# EAGLE design HAP-ControlUnit-DIL-3.0 (EAGLE 5.04)
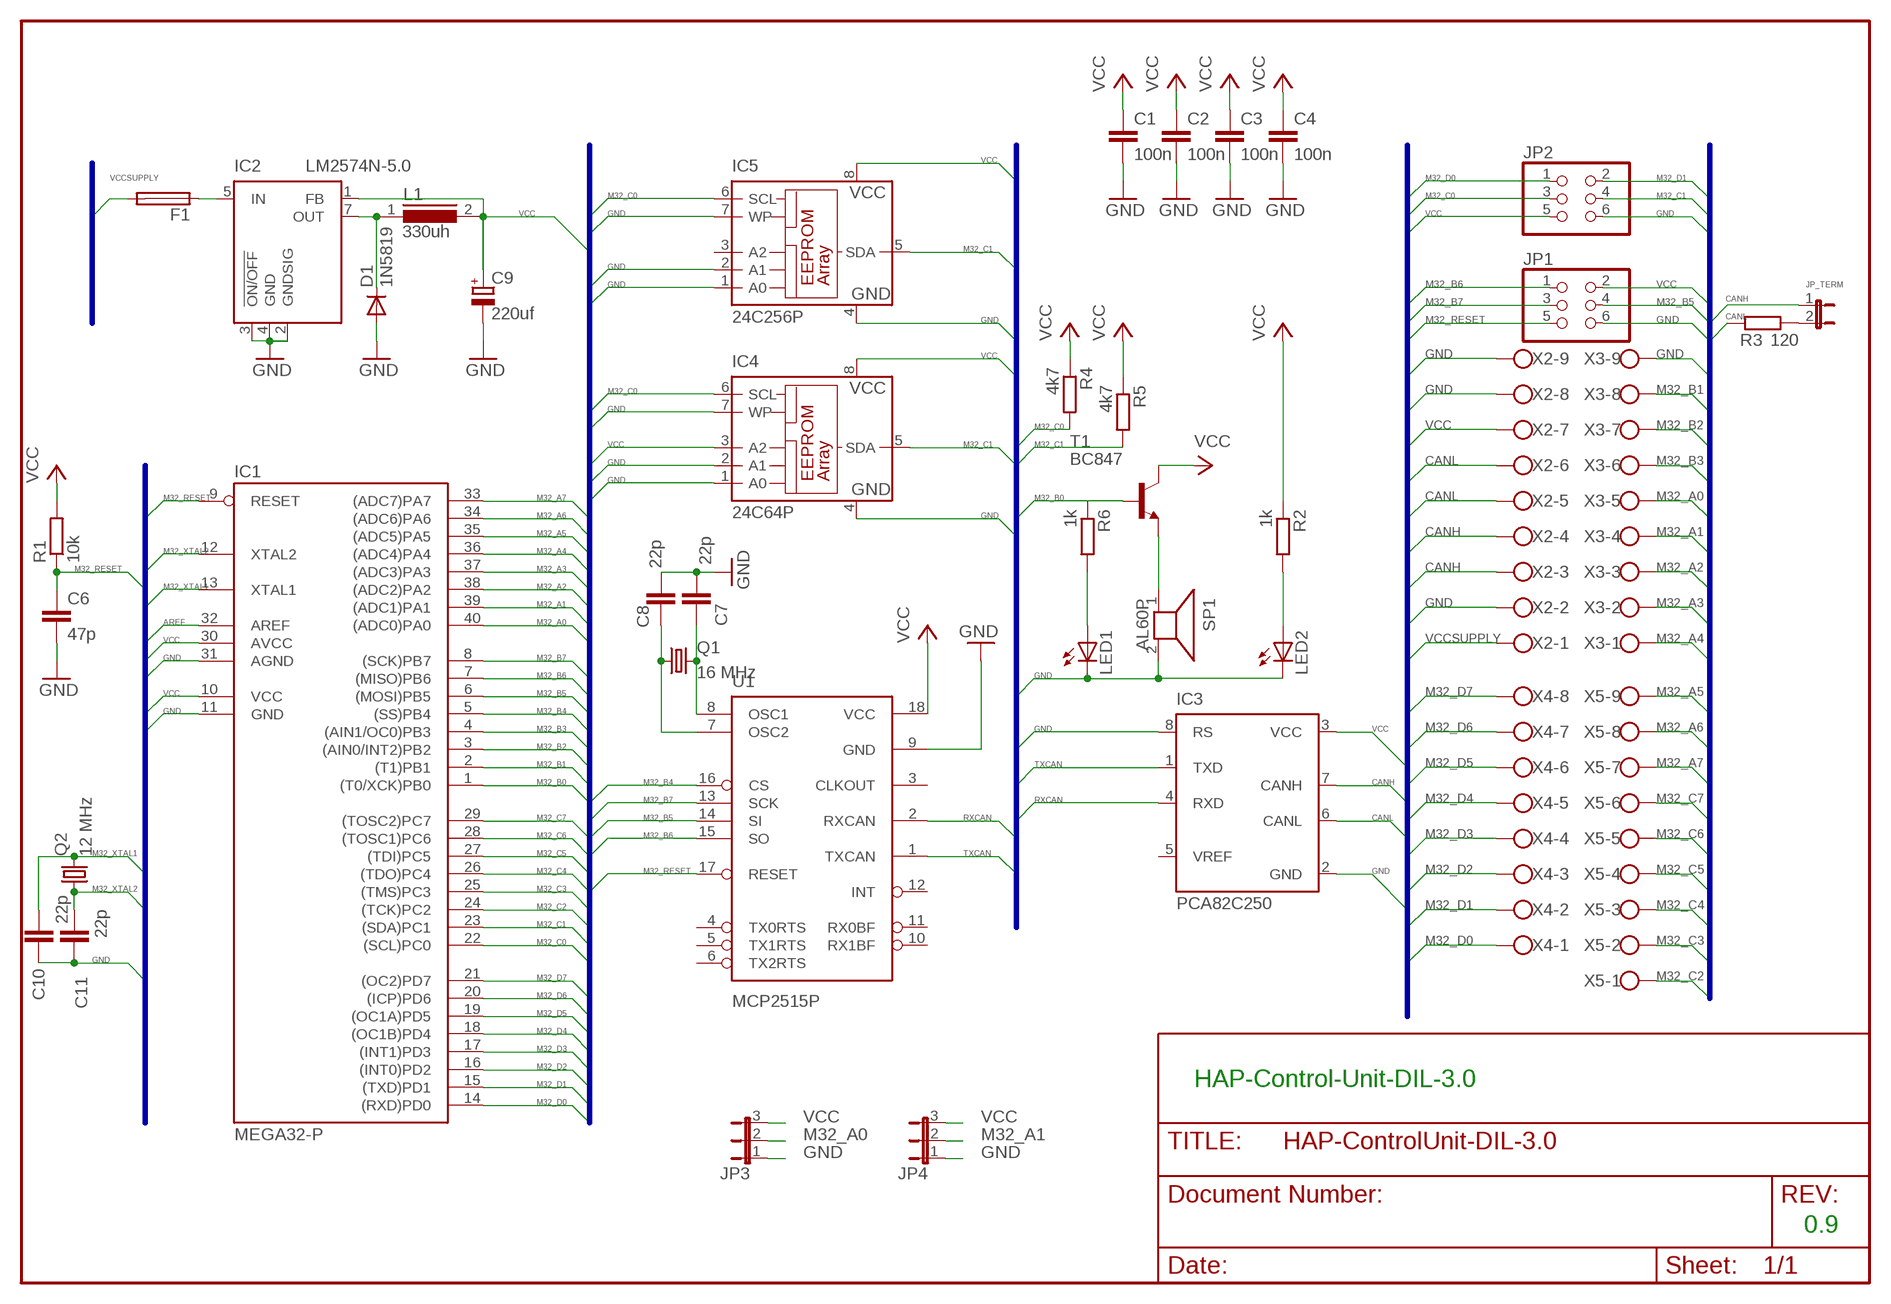
[diagram p0: schematic, sheet 1]

## Parts
C1  100n  C-EUC0805  [C0805]
C2  100n  C-EUC0805  [C0805]
C3  100n  C-EUC0805  [C0805]
C4  100n  C-EUC0805  [C0805]
C6  47p  C-EUC0805  [C0805]
C7  22p  C-EUC0805  [C0805]
C8  22p  C-EUC0805  [C0805]
C9  220uf  CPOL-EUE3.5-8  [E3,5-8]
C10  22p  C-EUC0805  [C0805]
C11  22p  C-EUC0805  [C0805]
D1  1N5819  1N4446  [DO35-10]
F1  TR5  [TR5]
IC1  MEGA32-P  [DIL40]
IC2  LM2574N-5.0  [DIL08]
IC3  PCA82C250  [DIL08]
IC4  24C64P  [DIL8]
IC5  24C256P  24C64P  [DIL8]
JP1  PINHD-2X3  [2X03]
JP2  PINHD-2X3  [2X03]
JP3  JP2E  [JP2]
JP4  JP2E  [JP2]
JP_TERM  JP1E  [JP1]
L1  330uh  82114R  [82114R]
LED1  LED3MM  [LED3MM]
LED2  LED3MM  [LED3MM]
Q1  16 MHz  CRYSTALHC49U70  [HC49U70]
Q2  12 MHz  CRYSTALHC49U70  [HC49U70]
R1  10k  R-EU_R0805  [R0805]
R2  1k  R-EU_R0805  [R0805]
R3  120  R-EU_R0805  [R0805]
R4  4k7  R-EU_R0805  [R0805]
R5  4k7  R-EU_R0805  [R0805]
R6  1k  R-EU_R0805  [R0805]
SP1  AL60P  [AL60P]
T1  BC847  [SOT23]
U1  MCP2515P  MCP2510P  [DIL18]
X2  W237-09P  [W237-9P]
X3  W237-09P  [W237-9P]
X4  W237-08P  [W237-8P]
X5  W237-09P  [W237-9P]

## Nets
AREF: IC1.32(AREF)
CANH: IC3.7(CANH) JP_TERM.1 X2.3 X2.4
CANL: IC3.6(CANL) R3.1 X2.5 X2.6
GND [VCC_GND]: C1.2 C2.2 C3.2 C4.2 C6.2 C7.2 C8.2 C9.- C10.2 C11.1 D1.A IC1.11(GND) IC1.31(AGND) IC2.2(GNDSIG) IC2.3(!ON/OFF) IC2.4(GND) IC3.2(GND) IC3.8(RS) IC4.1(A0) IC4.2(A1) IC4.4(GND) IC4.7(WP) IC5.1(A0) IC5.2(A1) IC5.4(GND) IC5.7(WP) JP1.6 JP2.6 JP3.1 JP4.1 LED1.K(C) LED2.K(C) SP1.2 U1.9(GND) X2.2 X2.8 X2.9 X3.9
M32_A0: IC1.40((ADC0)PA0) JP3.2 X3.5
M32_A1: IC1.39((ADC1)PA1) JP4.2 X3.4
M32_A2: IC1.38((ADC2)PA2) X3.3
M32_A3: IC1.37((ADC3)PA3) X3.2
M32_A4: IC1.36((ADC4)PA4) X3.1
M32_A5: IC1.35((ADC5)PA5) X5.9
M32_A6: IC1.34((ADC6)PA6) X5.8
M32_A7: IC1.33((ADC7)PA7) X5.7
M32_B0: IC1.1((T0/XCK)PB0) R6.1 T1.1(B)
M32_B1: IC1.2((T1)PB1) X3.8
M32_B2: IC1.3((AIN0/INT2)PB2) X3.7
M32_B3: IC1.4((AIN1/OC0)PB3) X3.6
M32_B4: IC1.5((SS)PB4) U1.16(CS)
M32_B5: IC1.6((MOSI)PB5) JP1.4 U1.14(SI)
M32_B6: IC1.7((MISO)PB6) JP1.1 U1.15(SO)
M32_B7: IC1.8((SCK)PB7) JP1.3 U1.13(SCK)
M32_C0: IC1.22((SCL)PC0) IC4.6(SCL) IC5.6(SCL) JP2.3 R4.2
M32_C1: IC1.23((SDA)PC1) IC4.5(SDA) IC5.5(SDA) JP2.4 R5.2
M32_C2: IC1.24((TCK)PC2) X5.1
M32_C3: IC1.25((TMS)PC3) X5.2
M32_C4: IC1.26((TDO)PC4) X5.3
M32_C5: IC1.27((TDI)PC5) X5.4
M32_C6: IC1.28((TOSC1)PC6) X5.5
M32_C7: IC1.29((TOSC2)PC7) X5.6
M32_D0: IC1.14((RXD)PD0) JP2.1 X4.1
M32_D1: IC1.15((TXD)PD1) JP2.2 X4.2
M32_D2: IC1.16((INT0)PD2) X4.3
M32_D3: IC1.17((INT1)PD3) X4.4
M32_D4: IC1.18((OC1B)PD4) X4.5
M32_D5: IC1.19((OC1A)PD5) X4.6
M32_D6: IC1.20((ICP)PD6) X4.7
M32_D7: IC1.21((OC2)PD7) X4.8
M32_RESET: C6.1 IC1.9(RESET) JP1.5 R1.1 U1.17(RESET)
M32_XTAL1: C10.1 IC1.13(XTAL1) Q2.2
M32_XTAL2: C11.2 IC1.12(XTAL2) Q2.1
N$1: LED1.A R6.2
N$2: D1.C IC2.7(OUT) L1.1
N$3: SP1.1 T1.2(E)
N$4: F1.1 IC2.5(IN)
N$5: C7.1 Q1.2 U1.8(OSC1)
N$6: JP_TERM.2 R3.2
N$7: C8.1 Q1.1 U1.7(OSC2)
N$16: LED2.A R2.2
RXCAN: IC3.4(RXD) U1.2(RXCAN)
TXCAN: IC3.1(TXD) U1.1(TXCAN)
VCC [VCC_GND]: C1.1 C2.1 C3.1 C4.1 C9.+ IC1.10(VCC) IC1.30(AVCC) IC2.1(FB) IC3.3(VCC) IC4.3(A2) IC4.8(VCC) IC5.8(VCC) JP1.2 JP2.5 JP3.3 JP4.3 L1.2 R1.2 R2.1 R4.1 R5.1 T1.3(C) U1.18(VCC) X2.7
VCCSUPPLY [VCC_GND]: F1.2 X2.1
Unconnected: IC3.5(VREF) IC5.3(A2) U1.3(CLKOUT) U1.4(TX0RTS) U1.5(TX1RTS) U1.6(TX2RTS) U1.10(RX1BF) U1.11(RX0BF) U1.12(INT)

## Buses
M32_RESET,M32_XTAL2,M32_XTAL1,M32_AREF,M32_AVCC,M32_AGND,M32_A[0..7],M32_B[0..7],M32_C[0..7],M32_D[0..7],VCC,GND,TXCAN,RXCAN,CANH,CANHB,CANL,CANLB,VCCSUPPLY,M32_XTAL1,M32_XTAL2,MCP_OSC1,MCP_OSC2,AREF

## Notes on the sheet
- HAP-Control-Unit-DIL-3.0
- 0.9

## Library data of the parts
C1-C4 C6-C8 C10 C11 = rcl:C-EU: CAPACITOR, European symbol
C9 = rcl:CPOL-EU: POLARIZED CAPACITOR, European symbol
D1 = diode:1N4446: DIODE high speed (Philips)
F1 = fuse:TR5: FUSE Wickmann
IC1 = atmel:MEGA32-P: MICROCONTROLLER 32 Kbytes FLASH 2 Kbytes SRAM 1 Kbytes EEPROM USART 8-channel 10 bit ADC Source: www.atmel.com .. doc2503.pdf
IC2 = linear:LM2574?-*: SIMPLE SWITCHER 0.5A Step-Down Voltage Regulator Source: http://cache.national.com/ds/LM/LM2574.pdf
IC3 = micro-philips:PCA82C250: CAN CONTROLLER INTERFACE
IC4 IC5 = microchip:24*: Serial EEPROM I2C
JP1 JP2 = pinhead:PINHD-2X3: PIN HEADER
JP3 JP4 = jumper:JP2E: JUMPER
JP_TERM = jumper:JP1E: JUMPER
L1 = inductors:82114R: INDUCTOR
LED1 LED2 = led:LED: LED OSRAM: - CHIPLED LG R971, LG N971, LY N971, LG Q971, LY Q971, LO R971, LY R971 LH N974, LH R974 LS Q976, LO Q976, LY Q976 LO Q996 - Hyper CHIPLED LW Q18S LB Q993, LB Q99A, LB R99A - SideLED LS A670, LO A670, LY A670, LG A670, LP A670 LB A673, LV A673, LT A673, LW A673 LH A674 LY A675 LS A676, LA A676, LO A676, LY A676, LW A676 LS A679, LY A679, LG A679 - Hyper Micro SIDELED® LS Y876, LA Y876, LO Y876, LY Y876 LT Y87S - SmartLED LW L88C, LW L88S LB L89C, LB L89S, LG L890 LS L89K, LO L89K, LY L89K LS L896, LA L896, LO L896, LY L896 - TOPLED LS T670, LO T670, LY T670, LG T670, LP T670 LSG T670, LSP T670, LSY T670, LOP T670, LYG T670 LG T671, LOG T671, LSG T671 LB T673, LV T673, LT T673, LW T673 LH T674 LS T676, LA T676, LO T676, LY T676, LB T676, LH T676, LSB T676, LW T676 LB T67C, LV T67C, LT T67C, LS T67K, LO T67K, LY T67K, LW E67C LS E67B, LA E67B, LO E67B, LY E67B, LB E67C, LV E67C, LT E67C LW T67C LS T679, LY T679, LG T679 LS T770, LO T770, LY T770, LG T770, LP T770 LB T773, LV T773, LT T773, LW T773 LH T774 LS E675, LA E675, LY E675, LS T675 LS T776, LA T776, LO T776, LY T776, LB T776 LHGB T686 LT T68C, LB T68C - Hyper Mini TOPLED® LB M676 - Mini TOPLED Santana® LG M470 LS M47K, LO M47K, LY M47K Source: http://www.osram.convergy.de - LUMILED® LXK2-PW12-R00, LXK2-PW12-S00, LXK2-PW14-U00, LXK2-PW14-V00 LXK2-PM12-R00, LXK2-PM12-S00, LXK2-PM14-U00 LXK2-PE12-Q00, LXK2-PE12-R00, LXK2-PE12-S00, LXK2-PE14-T00, LXK2-PE14-U00 LXK2-PB12-K00, LXK2-PB12-L00, LXK2-PB12-M00, LXK2-PB14-N00, LXK2-PB14-P00, LXK2-PB14-Q00 LXK2-PR12-L00, LXK2-PR12-M00, LXK2-PR14-Q00, LXK2-PR14-R00 LXK2-PD12-Q00, LXK2-PD12-R00, LXK2-PD12-S00 LXK2-PH12-R00, LXK2-PH12-S00 LXK2-PL12-P00, LXK2-PL12-Q00, LXK2-PL12-R00 Source: www.luxeon.com
Q1 Q2 = crystal:CRYSTAL: CRYSTAL
R1-R6 = rcl:R-EU_: RESISTOR, European symbol
SP1 = buzzer:AL60P: SPEAKER Source: Buerklin
T1 = transistor:BC847: NPN TRANSISTOR
U1 = microchip_can:MCP2510
X2 X3 X5 = con-wago-508:W237-09P: WAGO SREW CLAMP
X4 = con-wago-508:W237-08P: WAGO SREW CLAMP

## Net classes
1 VCC_GND: width 0.305 mm, clearance 0.203 mm

## Board
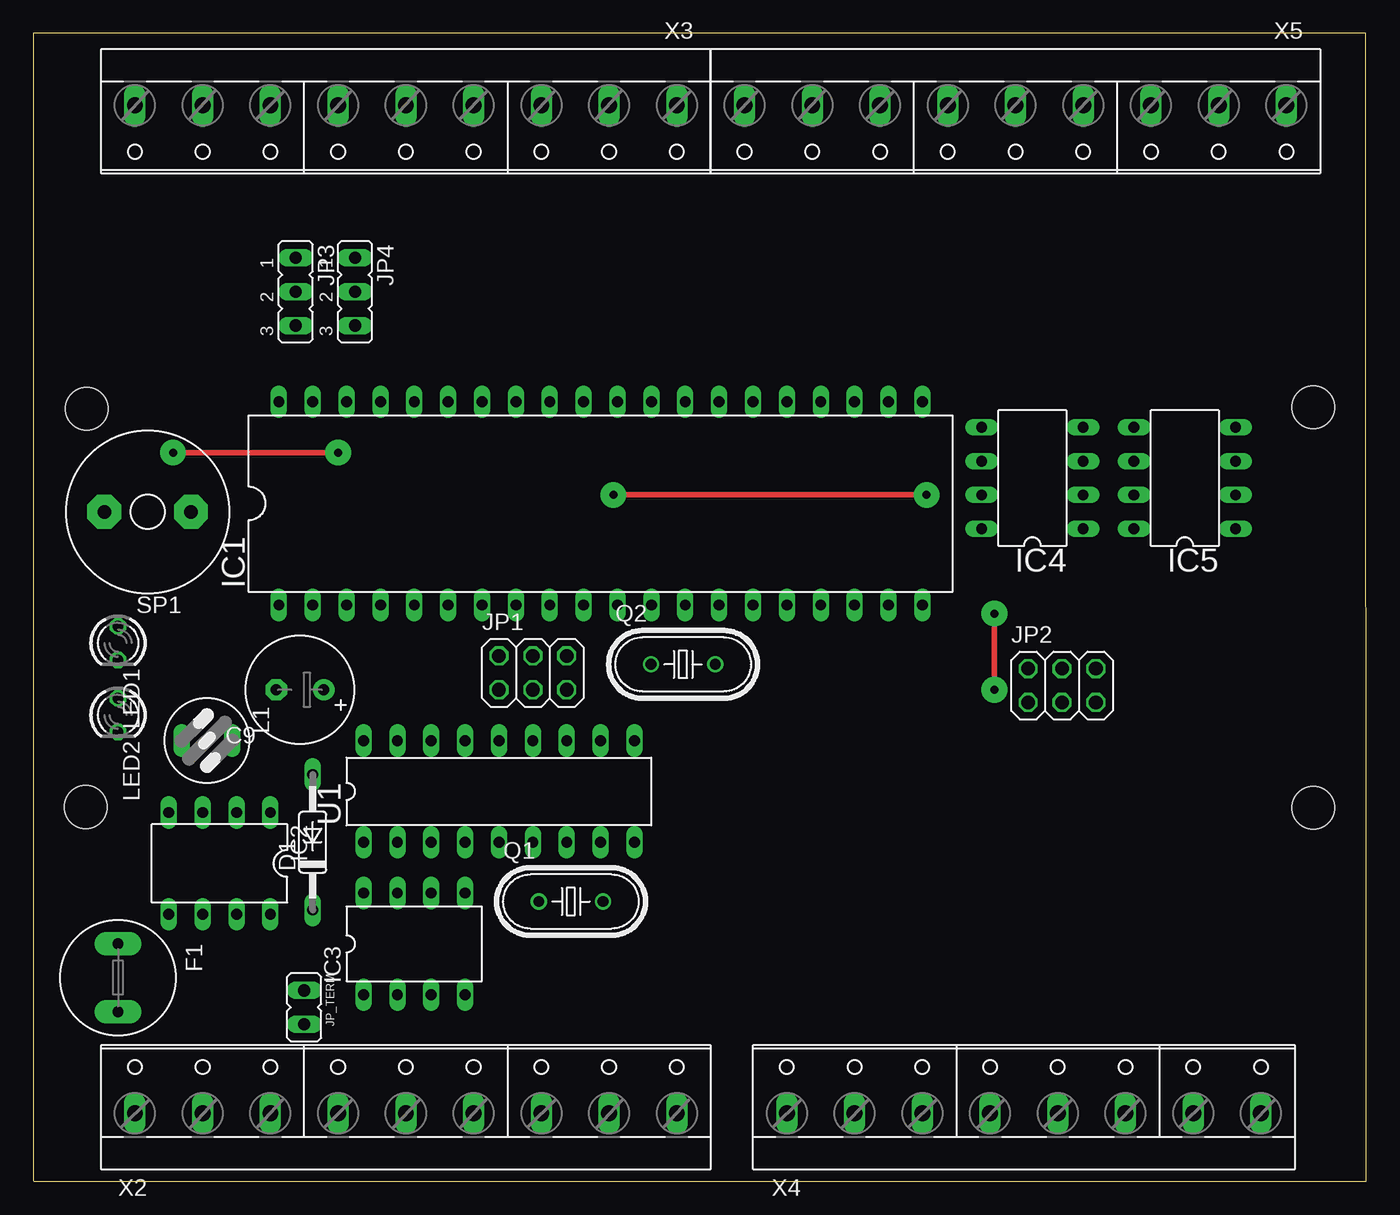
[diagram p1: board, top side]
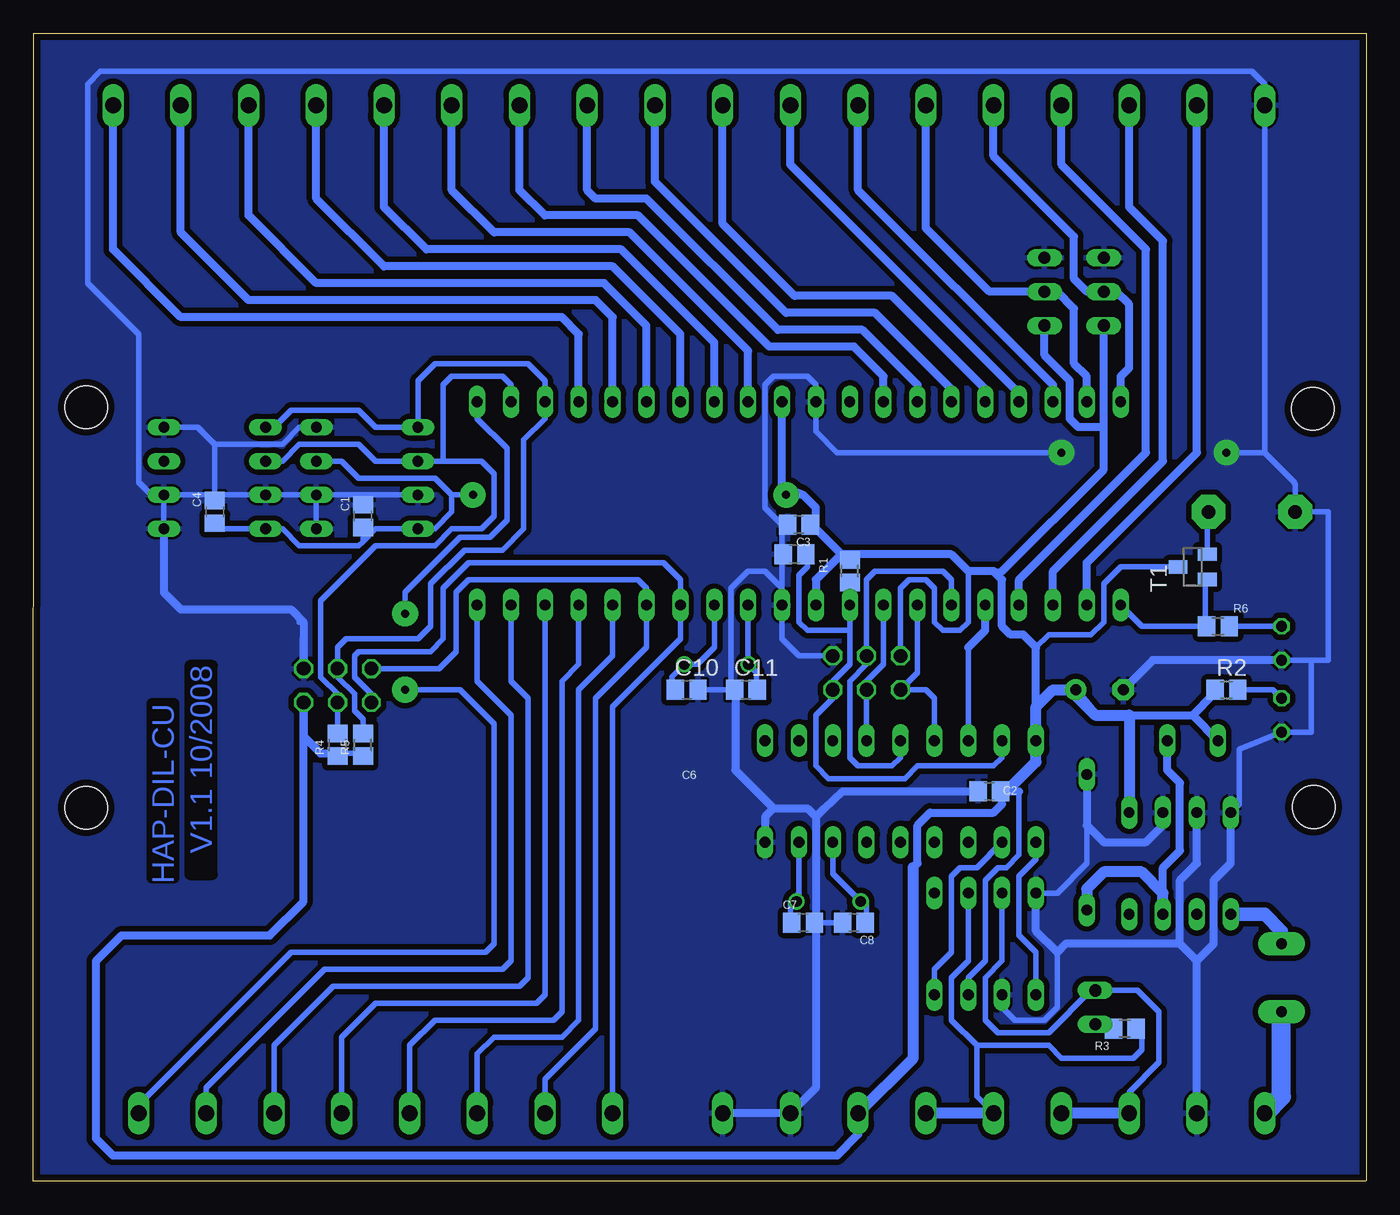
[diagram p2: board, bottom side, seen from below]

Size 99.97 x 86.08 mm. Coordinates in mm from the lower left corner, seen from the top.
Outline: 0.04,0 99.97,0 99.94,86.08 0,86.08 0,0.04
Copper layers (1*16): Top 0.035mm / dielectric 1.5mm / Bottom 0.035mm
Design rules "leiton *": minimum track width 6mil, minimum drill 12mil, track to track 16mil, track to pad 16mil, pad to pad 16mil, via to via 16mil, smd to smd 16mil, copper to edge 20mil, drill to drill 8mil, minimum pad ring 8mil, minimum via ring 6mil, stop-mask expansion 3mil, vias tented up to drill 0mil, thermal gap 8mil
Holes 3.2 mm at 4.01,57.94 96,28.01 3.94,28.07 96,58.04

### Footprints (pad centres in the part's own frame; a part is rotated, then mirrored left to right if it is on the bottom)
C0805 = smd 1.3 x 1.5: 1 -0.85,0; 2 0.85,0
E3,5-8 = drill 0.813 pad 1.6 round: + -1.778,0 | drill 0.813 pad 1.6 octagon: - 1.778,0
DO35-10 = drill 0.813 long: A 5.08,0; C -5.08,0
TR5 = drill 0.813 pad 1.778 long: 1 -2.54,0; 2 2.54,0
DIL40 = drill 0.813 long: 1 -24.13,-7.62; 2 -21.59,-7.62; 3 -19.05,-7.62; 4 -16.51,-7.62; 5 -13.97,-7.62; 6 -11.43,-7.62; 7 -8.89,-7.62; 8 -6.35,-7.62; 9 -3.81,-7.62; 10 -1.27,-7.62; 11 1.27,-7.62; 12 3.81,-7.62; 13 6.35,-7.62; 14 8.89,-7.62; 15 11.43,-7.62; 16 13.97,-7.62; 17 16.51,-7.62; 18 19.05,-7.62; 19 21.59,-7.62; 20 24.13,-7.62; 21 24.13,7.62; 22 21.59,7.62; 23 19.05,7.62; 24 16.51,7.62; 25 13.97,7.62; 26 11.43,7.62; 27 8.89,7.62; 28 6.35,7.62; 29 3.81,7.62; 30 1.27,7.62; 31 -1.27,7.62; 32 -3.81,7.62; 33 -6.35,7.62; 34 -8.89,7.62; 35 -11.43,7.62; 36 -13.97,7.62; 37 -16.51,7.62; 38 -19.05,7.62; 39 -21.59,7.62; 40 -24.13,7.62
DIL08 = drill 0.813 long: 1 -3.81,-3.81; 2 -1.27,-3.81; 3 1.27,-3.81; 4 3.81,-3.81; 5 3.81,3.81; 6 1.27,3.81; 7 -1.27,3.81; 8 -3.81,3.81
DIL8 = drill 0.813 long: 1 -3.81,-3.81; 2 -1.27,-3.81; 3 1.27,-3.81; 4 3.81,-3.81; 5 3.81,3.81; 6 1.27,3.81; 7 -1.27,3.81; 8 -3.81,3.81
2X03 = drill 1.016 octagon: 1 -2.54,-1.27; 2 -2.54,1.27; 3 0,-1.27; 4 0,1.27; 5 2.54,-1.27; 6 2.54,1.27
JP2 = drill 0.914 long: 1 -2.54,0; 2 0,0; 3 2.54,0
JP1 = drill 0.914 long: 1 0,-1.27; 2 0,1.27
82114R = drill 0.813 long: 1 0,1.905; 2 0,-1.905
LED3MM = drill 0.813 octagon: A -1.27,0; K 1.27,0
HC49U70 = drill 0.813 round: 1 -2.413,0; 2 2.413,0
R0805 = smd 1.3 x 1.5: 1 -0.85,0; 2 0.85,0
AL60P = drill 1.016 pad 2.54 octagon: 1 -3.251,0; 2 3.251,0
SOT23 = smd 1 x 1.4: 1 -0.95,-1.1; 2 0.95,-1.1; 3 0,1.1
DIL18 = drill 0.813 long: 1 -10.16,-3.81; 2 -7.62,-3.81; 3 -5.08,-3.81; 4 -2.54,-3.81; 5 0,-3.81; 6 2.54,-3.81; 7 5.08,-3.81; 8 7.62,-3.81; 9 10.16,-3.81; 10 10.16,3.81; 11 7.62,3.81; 12 5.08,3.81; 13 2.54,3.81; 14 0,3.81; 15 -2.54,3.81; 16 -5.08,3.81; 17 -7.62,3.81; 18 -10.16,3.81
W237-9P = drill 1.194 long: 1 -20.32,-0.635; 2 -15.24,-0.635; 3 -10.16,-0.635; 4 -5.08,-0.635; 5 0,-0.635; 6 5.08,-0.635; 7 10.16,-0.635; 8 15.24,-0.635; 9 20.32,-0.635
W237-8P = drill 1.194 long: 1 -17.78,-0.635; 2 -12.7,-0.635; 3 -7.62,-0.635; 4 -2.54,-0.635; 5 2.54,-0.635; 6 7.62,-0.635; 7 12.7,-0.635; 8 17.78,-0.635

### Placement (x,y rotation side)
C1  75.25,49.88 90 bottom
C2  28.26,29.25 180 bottom
C3  42.55,49.25 180 bottom
C4  86.36,50.2 90 bottom
C6  42.86,47.02 180 bottom
C7  42.23,19.4 0 bottom
C8  38.42,19.4 180 bottom
C9  20,36.86 180 top
C10  50.96,36.86 0 bottom
C11  46.51,36.86 0 bottom
D1  20.95,25.43 90 top
F1  6.35,15.28 270 top
IC1  42.55,50.83 0 top
IC2  13.97,23.85 180 top
IC3  28.57,17.82 0 top
IC4  74.93,52.74 90 top
IC5  86.36,52.74 90 top
JP1  37.47,38.13 0 top
JP2  77.15,37.18 0 top
JP3  19.68,66.71 270 top
JP4  24.13,66.71 270 top
JP_TERM  20.32,13.05 180 top
L1  13.02,33.05 270 top
LED1  6.35,40.36 270 top
LED2  6.35,34.96 270 top
Q1  40.32,20.99 0 top
Q2  48.74,38.77 0 top
R1  38.73,45.75 90 bottom
R2  10.48,36.86 0 bottom
R3  18.1,11.46 180 bottom
R4  77.15,32.74 90 bottom
R5  75.25,32.74 90 bottom
R6  11.11,41.63 0 bottom
SP1  8.57,50.2 180 top
T1  13.02,46.07 90 bottom
U1  34.92,29.25 0 top
X2  27.94,5.75 0 top
X3  27.94,80.05 180 top
X4  74.3,5.75 0 top
X5  73.66,80.05 180 top

### Tracks (layer width: path | path; a pad name or v marks a point on that pad's centre or on a via)
CANH
  Bottom 0.406: IC3.7 27.3,16.55 28.57,15.28 28.57,12.1 27.62,11.15 23.81,11.15 20.64,14.32 JP_TERM.1 17.14,14.32 15.56,12.73 15.56,8.93 17.78,6.7 X2.3
  Bottom 0.813: X2.3 X2.4
CANL
  Bottom 0.406: IC3.6 29.84,16.55 31.11,15.28 31.11,12.1 29.21,10.2 | 29.21,10.2 23.81,10.2 22.86,9.24 17.46,9.24 16.83,9.88 16.83,11.36 R3.1 | X2.5 29.21,6.38 29.21,10.2
  Bottom 0.813: X2.5 X2.6
GND  (via drill 0.6 pad 1.93)
  Top 0.406: v10.48,54.64 v22.86,54.64
  Bottom 0.406: JP1.6 42.55,39.4 43.81,40.67 IC1.11 43.81,44.48 | 43.81,49.25 45.09,50.52 45.09,59.72 44.45,60.36 41.91,60.36 41.27,59.72 IC1.31 41.27,56.23 39.69,54.64 v22.86,54.64 | 43.81,48.61 43.81,44.48 | 43.81,49.25 43.81,48.61 | 47.62,36.86 C11.1 | 47.62,36.86 C10.2 | 47.62,36.86 47.62,44.48 46.35,45.75 45.09,45.75 43.81,44.48 | IC4.4 80.01,56.55 81.28,55.28 86.36,55.28 | 86.36,55.28 87.63,56.55 IC5.4 | 75.25,51.47 IC4.7 IC5.2 | 75.25,51.47 IC4.2 | IC4.2 IC5.7 86.36,51.47 | IC5.2 86.36,51.47 | 86.36,51.47 86.36,55.28 | IC5.2 IC5.1 | IC4.2 IC4.1 | 41.59,19.4 C7.2 C8.2 | SP1.2 2.86,50.2 2.86,39.09 LED1.K 4.13,39.09 4.13,33.69 LED2.K 9.53,32.42 9.53,28.29 IC2.4 | 7.62,54.64 X3.9 | SP1.2 5.08,50.2 | 43.81,49.25 C3.2 | C6.2 43.81,47.13 43.81,48.61 | 75.25,51.47 C1.2 | 86.36,51.47 C4.2 | IC5.2 91.12,51.47 92.08,52.42 92.08,63.53 95.89,67.34 95.89,82.27 94.93,83.22 8.57,83.22 7.62,82.27 X3.9 | X3.9 7.94,80.36 | 7.62,54.64 v10.48,54.64 | SP1.2 5.32,52.18 5.4,52.42 7.62,54.64 | 79.69,41.94 80.01,41.94 | IC3.2 27.3,13.05 26.35,12.1 24.13,12.1 23.18,13.05 23.18,17.18 | IC3.8 23.18,21.62 20.95,23.85 D1.A
  Bottom 0.61: 41.59,19.4 41.27,19.72 41.27,27.34 | 41.27,27.34 41.91,27.98 44.45,27.98 | 44.45,27.98 45.09,27.34 U1.9 | C2.2 39.27,29.25 40.64,27.98 41.27,27.34 | X2.8 42.86,5.12 | X2.8 X2.9 | C7.2 41.27,19.3 41.27,7.02 X2.8 | C11.1 47.31,36.86 47.31,30.83 44.45,27.98 | IC5.1 90.17,44.17 88.9,42.9 80.64,42.9 79.69,41.94 JP2.6 79.69,40.67 | X2.2 12.7,16.55 | 12.7,16.55 11.43,17.82 11.43,22.58 10.16,23.85 IC2.4 | IC2.3 12.7,23.85 13.97,22.58 13.97,17.82 | 12.7,16.55 13.97,17.82 | C9.- 16,39.09 LED1.K | IC2.2 15.24,26.71 16.51,25.43 19.68,25.43 20.95,26.71 D1.A | 13.97,17.82 22.54,17.82 23.18,17.18 24.77,18.77 IC3.8
  Bottom 1.422: X2.2 12.7,5.43
  pour Bottom: 0,0.04 100.01,0.04 100.01,86.08 0,86.08
M32_A0
  Bottom 0.406: 18.73,66.71 JP3.2 20.95,66.71
  Bottom 0.61: 27.94,80.36 X3.5 | 27.94,80.36 27.94,79.41 | IC1.40 18.41,60.36 17.78,60.99 17.78,65.76 18.73,66.71 | 20.95,66.71 21.91,67.66 21.91,70.84 27.94,76.87 27.94,80.36
M32_A1
  Bottom 0.61: IC1.39 20.95,59.72 20.95,60.36 21.91,61.31 21.91,65.44 23.18,66.71 JP4.2 28.26,66.71 33.02,71.47 X3.4
M32_A2
  Bottom 0.61: X3.3 38.1,74.33 23.5,59.72 IC1.38
M32_A3
  Bottom 0.61: X3.2 43.18,76.23 26.04,59.09 IC1.37
M32_A4
  Bottom 0.61: IC1.36 28.57,59.41 35.56,66.39 42.86,66.39 48.26,71.79 X3.1
M32_A5
  Bottom 0.61: X5.9 53.34,74.97 43.5,65.12 36.83,65.12 31.11,59.41 IC1.35
M32_A6
  Bottom 0.61: IC1.34 33.66,59.72 37.78,63.85 44.13,63.85 53.98,73.69 57.78,73.69 58.42,74.33 X5.8
M32_A7
  Bottom 0.61: X5.7 63.5,74.33 61.59,72.42 54.61,72.42 44.77,62.58 38.42,62.58 36.2,60.36 IC1.33
M32_B0
  Bottom 0.406: R6.1 12.06,41.73 12.06,42.58 | T1.1 12.06,45.12 12.06,42.58 | 12.06,42.58 12.06,41.63 16.83,41.63 IC1.1
M32_B1
  Bottom 0.61: IC1.2 20.95,46.39 12.7,54.64 X3.8
M32_B2
  Bottom 0.61: IC1.3 23.5,45.75 15.24,54.01 15.24,70.52 17.78,73.06 X3.7
M32_B3
  Bottom 0.61: IC1.4 26.04,45.12 16.51,54.64 16.51,69.88 22.86,76.23 X3.6
M32_B4
  Bottom 0.406: U1.16 29.84,40.04
  Bottom 0.61: IC1.5 28.57,41.31 29.84,40.04
M32_B5
  Bottom 0.406: IC1.6 31.11,45.12 31.75,45.75 36.83,45.75 37.47,45.12 JP1.4 37.47,38.77 38.73,37.5 38.73,31.79 38.1,31.15 35.56,31.15 34.92,31.79 U1.14
M32_B6
  Bottom 0.406: IC1.7 33.66,38.13 JP1.1 33.02,36.86 32.38,36.23 U1.15
M32_B7
  Bottom 0.406: IC1.8 36.2,38.77 37.47,37.5 JP1.3 U1.13
M32_C0
  Bottom 0.406: IC1.22 64.14,59.72 64.77,60.36 68.58,60.36 69.22,59.72 69.22,54.01 IC4.6 | IC4.6 74.3,54.01 75.56,55.28 80.01,55.28 81.28,54.01 IC5.6 | IC4.6 66.36,54.01 65.41,53.06 65.41,49.88 66.36,48.93 68.58,48.93 69.85,47.66 74.3,47.66 78.42,43.53 78.42,37.82 77.15,36.55 JP2.3 R4.2
M32_C1
  Bottom 0.406: IC5.5 81.92,56.55 80.64,57.82 75.56,57.82 74.3,56.55 IC4.5 71.12,60.04 69.85,61.31 62.87,61.31 61.59,60.04 IC1.23 61.59,57.18 63.18,55.6 63.18,48.93 64.77,47.34 67.63,47.34 70.17,44.8 70.17,41.63 71.12,40.67 76.52,40.67 77.15,40.04 JP2.4 77.15,37.82 75.88,36.55 75.88,35.28 75.25,34.64 R5.2
M32_C2
  Bottom 0.61: IC1.24 59.05,63.53 60.33,64.8 88.9,64.8 93.98,69.88 X5.1
M32_C3
  Bottom 0.61: IC1.25 56.52,64.8 57.78,66.08 83.82,66.08 88.9,71.16 X5.2
M32_C4
  Bottom 0.61: IC1.26 53.98,64.17 57.15,67.34 78.74,67.34 83.82,72.42 X5.3
M32_C5
  Bottom 0.61: IC1.27 51.44,63.53 56.52,68.61 73.66,68.61 78.74,73.69 X5.4
M32_C6
  Bottom 0.61: IC1.28 48.9,62.9 55.88,69.88 70.48,69.88 73.66,73.06 X5.5
M32_C7
  Bottom 0.61: IC1.29 46.35,62.26 55.24,71.16 65.41,71.16 68.58,74.33 X5.6
M32_D0
  Bottom 0.406: X4.1 56.52,35.59 51.44,40.67 IC1.14 51.44,45.12 52.7,46.39 67.31,46.39 69.22,44.48 69.22,40.67 70.17,39.72 75.56,39.72 75.88,39.4 75.88,37.82 74.61,36.55 JP2.1
M32_D1
  Bottom 0.406: JP2.2 69.53,38.45 68.26,39.72 68.26,44.17 67.63,44.8 67.31,45.12 54.61,45.12 53.98,44.48 IC1.15 53.98,40.04 57.78,36.23 57.78,11.46 61.59,7.66 X4.2
M32_D2
  Bottom 0.406: IC1.16 56.52,39.4 59.05,36.86 59.05,12.1 60.33,10.83 65.41,10.83 66.67,9.56 X4.3
M32_D3
  Bottom 0.406: IC1.17 59.05,38.77 60.33,37.5 60.33,12.73 60.96,12.1 69.85,12.1 71.75,10.2 X4.4
M32_D4
  Bottom 0.406: IC1.18 61.59,14.01 62.23,13.37 74.3,13.37 76.83,10.83 X4.5
M32_D5
  Bottom 0.406: IC1.19 64.14,37.5 62.87,36.23 62.87,15.28 63.5,14.64 77.47,14.64 81.92,10.2 X4.6
M32_D6
  Bottom 0.406: IC1.20 66.67,37.5 64.14,34.96 64.14,16.55 64.77,15.91 78.11,15.91 87,7.02 X4.7
M32_D7  (via drill 0.6 pad 1.93)
  Top 0.406: v72.07,36.86 v72.07,42.58
  Bottom 0.406: X4.8 92.08,5.75 80.64,17.18 66.04,17.18 65.41,17.82 65.41,34.32 67.94,36.86 v72.07,36.86 | IC1.21 66.67,57.18 64.45,54.96 64.45,49.56 65.72,48.29 67.94,48.29 72.07,44.17 v72.07,42.58
M32_RESET
  Bottom 0.406: 38.73,41.31 38.73,38.77 40.01,37.5 JP1.5 40.01,36.23 41.27,34.96 41.27,31.15 40.32,30.2 35.24,30.2 34.61,30.2 33.66,31.15 27.94,31.15 27.3,31.79 U1.17 | 38.73,41.31 IC1.9 R1.1 | C6.1 41.91,46.92 41.91,46.07 42.55,45.44 42.55,41.94 41.91,41.31 38.73,41.31
M32_XTAL1
  Bottom 0.406: IC1.13 48.9,40.04 50.16,38.77 Q2.2 52.07,37.85 52.07,36.86 C10.1
M32_XTAL2
  Bottom 0.406: IC1.12 46.35,38.77 Q2.1 45.72,38.17 45.72,36.86 C11.2
N$1
  Bottom 0.406: R6.2 9.95,41.94 10.16,41.63 LED1.A
N$2
  Bottom 0.61: IC2.7 15.24,23.53 13.97,24.8 13.97,29.88 14.92,30.83 L1.1
  Bottom 0.813: IC2.7 15.24,21.62 16.83,23.21 19.68,23.21 20.95,21.94 D1.C
N$3
  Bottom 0.406: SP1.1 11.75,50.2 11.92,49.39 T1.2
N$4
  Bottom 1.016: F1.1 6.35,18.77 7.62,20.04 IC2.5
N$5
  Bottom 0.406: 42.55,21.18 Q1.2 42.86,20.99 43.18,20.67 43.18,19.5 | C7.1 43.18,19.5 | 43.18,19.5 43.18,20.99 42.55,21.62 U1.8
N$6
  Bottom 0.406: R3.2 19.27,11.15 19.37,11.78 JP_TERM.2
N$7
  Bottom 0.406: C8.1 37.47,19.5 37.47,20.67 37.78,20.99 Q1.1 40.01,23.09 U1.7
N$16
  Bottom 0.406: LED2.A 6.99,36.86 R2.2
RXCAN
  Bottom 0.406: IC3.4 32.38,15.91 31.11,17.18 31.11,22.89 30.48,23.53 29.21,23.53 U1.2
TXCAN
  Bottom 0.406: IC3.1 24.77,17.18 26.04,18.45 26.04,22.89 24.77,24.16 U1.1
VCC  (via drill 0.6 pad 1.93)
  Top 0.406: v43.5,51.47 v66.99,51.47
  Bottom 0.406: 29.84,45.75 29.84,41.94 30.48,41.31 31.75,41.31 32.38,41.94 32.38,44.48 33.02,45.12 34.29,45.12 34.92,44.48 JP1.2 | 43.18,51.47 43.81,52.1 v43.5,51.47 | 41.27,48.93 41.27,49.25 C3.1 | IC4.3 76.83,54.01 75.56,52.74 69.85,52.74 68.58,51.47 | 68.58,51.47 68.58,50.2 69.85,48.93 IC4.8 74.3,48.93 75.25,47.98 | 75.25,47.98 75.56,47.66 80.01,47.66 81.28,48.93 IC5.8 85.94,48.93 C4.1 | R5.1 75.46,32.1 77.15,32.1 R4.1 77.37,32.1 77.47,32.1 | IC3.3 29.84,15.28 28.57,16.55 28.57,22.58 27.62,23.53 26.99,23.53 26.04,24.48 26.04,29.25 | 38.73,47.02 R1.2 | 75.25,47.98 C1.1 | v66.99,51.47 68.58,51.47 | T1.3 18.41,46.07 19.68,44.8 19.68,41.94 20.64,40.99 23.81,40.99 24.77,40.04 | 11.43,36.55 R2.1 | 27.94,45.75 27.3,45.75
  Bottom 0.61: IC1.10 41.27,45.12 39.37,47.02 | 39.37,47.02 38.73,47.02 31.11,47.02 29.84,45.75 27.94,45.75 27.3,45.12 27.3,41.63 26.67,40.99 25.72,40.99 24.77,40.04 U1.18 | 42.23,51.47 43.18,51.47 | IC1.30 43.81,52.1 42.23,51.47 | 42.23,51.47 41.27,50.52 41.27,49.25 | 39.37,47.02 41.27,48.93 | 26.04,29.25 27.3,29.25 27.3,28.29 27.94,27.66 32.7,27.66 33.66,26.71 33.66,23.85 33.97,23.53 | X2.7 38.1,3.53 39.69,1.94 93.98,1.94 95.25,3.21 95.25,16.55 93.34,18.45 82.23,18.45 79.69,20.99 JP2.5 79.69,33.37 78.42,32.1 77.47,32.1 | 13.02,34.96 11.43,36.55 | C9.+ 20.19,34.96 17.78,34.96 13.02,34.96 | 13.02,34.96 L1.2 | C9.+ 21.59,36.86 | C9.+ 21.91,36.86 20.32,34.96 | 19.68,56.55 JP3.3 | JP4.3 24.13,61.95 22.23,60.04 22.23,57.18 21.59,56.55 19.68,56.55 | 19.68,56.55 19.68,53.38 27.3,45.75
  Bottom 0.813: X2.7 33.97,9.24 33.97,23.53 | IC2.1 17.78,34.96 20.32,34.96 21.91,36.55 21.91,36.86 23.5,36.86 24.77,35.59 U1.18 24.77,31.47 26.99,29.25 27.3,29.25 C2.1
VCCSUPPLY
  Bottom 0.813: 6.35,6.38 6.35,10.51
  Bottom 1.422: X2.1 6.35,6.38 F1.2

### Text on the board
Bottom: V1.1 10/2008 | HAP-DIL-CU